# EAGLE schematic IR remote sensor (EAGLE 9.5.2)
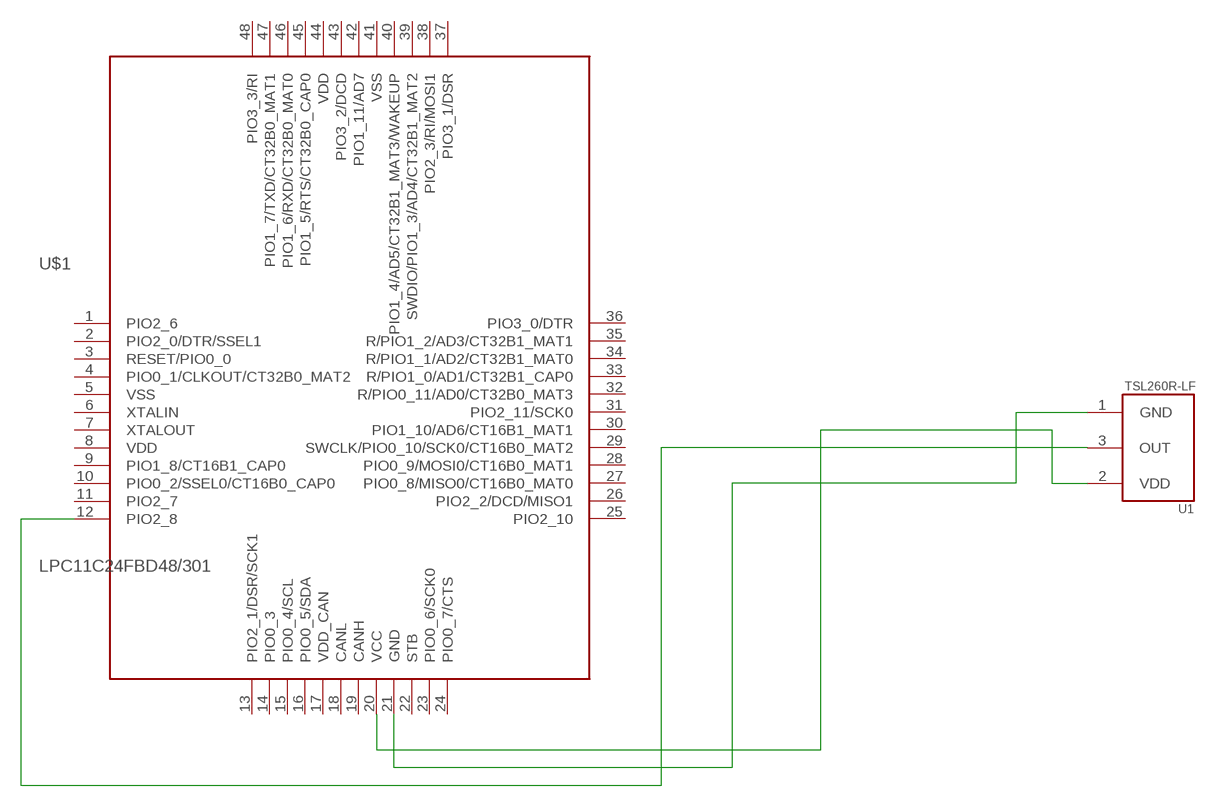
[diagram p0: schematic, sheet 1]

## Parts
U1  TSL260R-LF  [XDCR_TSL260R-LF]
U$1  LPC11C24FBD48/301  [QFP50P900X900X160-48N]

## Nets
N$2: U1.3(OUT) U$1.12(PIO2_8)
N$3: U1.2(VDD) U$1.20(VCC)
N$4: U1.1(GND) U$1.21(GND)
Unconnected: U$1.1(PIO2_6) U$1.2(PIO2_0/DTR/SSEL1) U$1.3(RESET/PIO0_0) U$1.4(PIO0_1/CLKOUT/CT32B0_MAT2) U$1.5(VSS) U$1.6(XTALIN) U$1.7(XTALOUT) U$1.8(VDD) U$1.9(PIO1_8/CT16B1_CAP0) U$1.10(PIO0_2/SSEL0/CT16B0_CAP0) U$1.11(PIO2_7) U$1.13(PIO2_1/DSR/SCK1) U$1.14(PIO0_3) U$1.15(PIO0_4/SCL) U$1.16(PIO0_5/SDA) U$1.17(VDD_CAN) U$1.18(CANL) U$1.19(CANH) U$1.22(STB) U$1.23(PIO0_6/SCK0) U$1.24(PIO0_7/CTS) U$1.25(PIO2_10) U$1.26(PIO2_2/DCD/MISO1) U$1.27(PIO0_8/MISO0/CT16B0_MAT0) U$1.28(PIO0_9/MOSI0/CT16B0_MAT1) U$1.29(SWCLK/PIO0_10/SCK0/CT16B0_MAT2) U$1.30(PIO1_10/AD6/CT16B1_MAT1) U$1.31(PIO2_11/SCK0) U$1.32(R/PIO0_11/AD0/CT32B0_MAT3) U$1.33(R/PIO1_0/AD1/CT32B1_CAP0) U$1.34(R/PIO1_1/AD2/CT32B1_MAT0) U$1.35(R/PIO1_2/AD3/CT32B1_MAT1) U$1.36(PIO3_0/DTR) U$1.37(PIO3_1/DSR) U$1.38(PIO2_3/RI/MOSI1) U$1.39(SWDIO/PIO1_3/AD4/CT32B1_MAT2) U$1.40(PIO1_4/AD5/CT32B1_MAT3/WAKEUP) U$1.41(VSS) U$1.42(PIO1_11/AD7) U$1.43(PIO3_2/DCD) U$1.44(VDD) U$1.45(PIO1_5/RTS/CT32B0_CAP0) U$1.46(PIO1_6/RXD/CT32B0_MAT0) U$1.47(PIO1_7/TXD/CT32B0_MAT1) U$1.48(PIO3_3/RI)

## Library data of the parts
U1 = TSL260R-LF:TSL260R-LF: Ic Ir Light-Volt Conv Sidelooker; AVAILABILITY: Unavailable; DESCRIPTION: Optical Sensor IR 940nm Voltage Radial - 3 Leads; MF: ams; MP: TSL260R-LF; PACKAGE: Radial-3 ams; PRICE: None
U$1 = QFP50P900X900X160-48N:LPC11C24FBD48/301